# Altium schematic sheet Brushless_Controller.SchDoc
size A
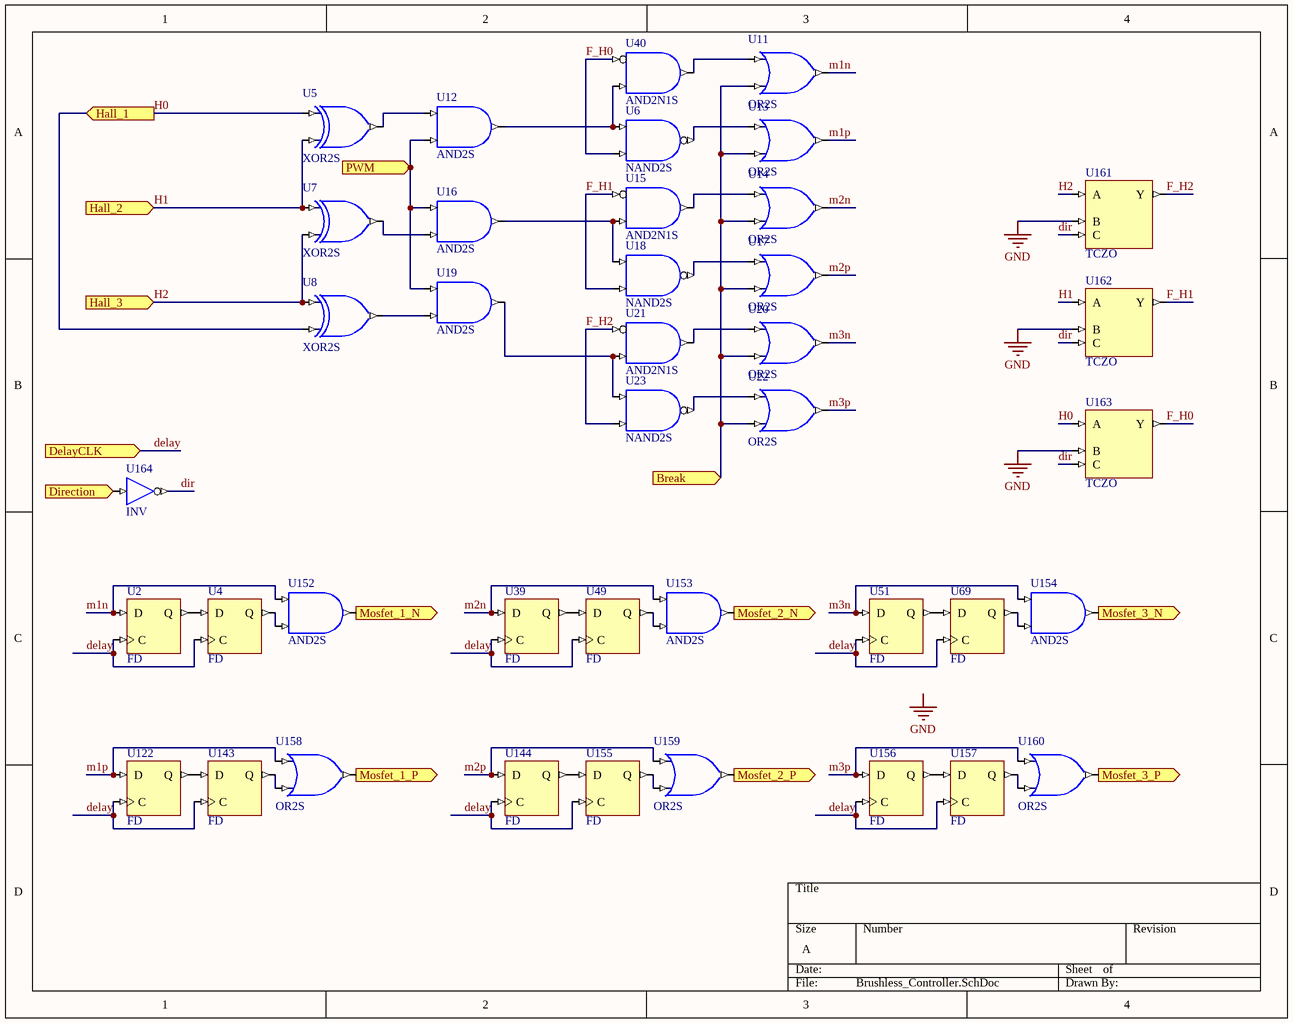
[diagram p0: Brushless_Controller.SchDoc]

## Parts
U2  FD
U4  FD
U5  XOR2S
U6  NAND2S
U7  XOR2S
U8  XOR2S
U11  OR2S
U12  AND2S
U13  OR2S
U14  OR2S
U15  AND2N1S
U16  AND2S
U17  OR2S
U18  NAND2S
U19  AND2S
U20  OR2S
U21  AND2N1S
U22  OR2S
U23  NAND2S
U39  FD
U40  AND2N1S
U49  FD
U51  FD
U69  FD
U122  FD
U143  FD
U144  FD
U152  AND2S
U153  AND2S
U154  AND2S
U155  FD
U156  FD
U157  FD
U158  OR2S
U159  OR2S
U160  OR2S
U161  TCZO
U162  TCZO
U163  TCZO
U164  INV

## Ports
Break (in), DelayCLK (in), Direction (in), Hall_1 (in), Hall_2 (in), Hall_3 (in), Mosfet_1_N (out), Mosfet_1_P (out), Mosfet_2_N (out), Mosfet_2_P (out), Mosfet_3_N (out), Mosfet_3_P (out), PWM (in)

## Nets
GND: U161.B U162.B U163.B
Break: U11.I1 U13.I1 U14.I1 U17.I1 U20.I1 U22.I1 ; port Break
delay: U2.C U4.C U39.C U49.C U51.C U69.C U122.C U143.C U144.C U155.C U156.C U157.C ; port DelayCLK
dir: U161.C U162.C U163.C U164.O
Direction: U164.I ; port Direction
F_H0: U6.I1 U40.I0 U163.Y
F_H1: U15.I0 U18.I1 U162.Y
F_H2: U21.I0 U23.I1 U161.Y
H0: U5.I0 U8.I1 U163.A ; port Hall_1
H1: U5.I1 U7.I0 U162.A ; port Hall_2
H2: U7.I1 U8.I0 U161.A ; port Hall_3
m1n: U2.D U11.O U152.I0
m1p: U13.O U122.D U158.I0
m2n: U14.O U39.D U153.I0
m2p: U17.O U144.D U159.I0
m3n: U20.O U51.D U154.I0
m3p: U22.O U156.D U160.I0
Mosfet_1_N: U152.O ; port Mosfet_1_N
Mosfet_1_P: U158.O ; port Mosfet_1_P
Mosfet_2_N: U153.O ; port Mosfet_2_N
Mosfet_2_P: U159.O ; port Mosfet_2_P
Mosfet_3_N: U154.O ; port Mosfet_3_N
Mosfet_3_P: U160.O ; port Mosfet_3_P
PWM: U12.I1 U16.I0 U19.I0 ; port PWM
NetU2_Q: U2.Q U4.D
NetU4_Q: U4.Q U152.I1
NetU5_O: U5.O U12.I0
NetU6_I0: U6.I0 U12.O U40.I1
NetU6_O: U6.O U13.I0
NetU7_O: U7.O U16.I1
NetU8_O: U8.O U19.I1
NetU11_I0: U11.I0 U40.O
NetU14_I0: U14.I0 U15.O
NetU15_I1: U15.I1 U16.O U18.I0
NetU17_I0: U17.I0 U18.O
NetU19_O: U19.O U21.I1 U23.I0
NetU20_I0: U20.I0 U21.O
NetU22_I0: U22.I0 U23.O
NetU39_Q: U39.Q U49.D
NetU49_Q: U49.Q U153.I1
NetU51_Q: U51.Q U69.D
NetU69_Q: U69.Q U154.I1
NetU122_Q: U122.Q U143.D
NetU143_Q: U143.Q U158.I1
NetU144_Q: U144.Q U155.D
NetU155_Q: U155.Q U159.I1
NetU156_Q: U156.Q U157.D
NetU157_Q: U157.Q U160.I1

## Notes on the sheet
- Labels drawn without touching a wire or pin: GND

## Library data of the parts
U2 U4 U39 U49 U51 U69 U122 U143 U144 U155-U157 = FD: D-Type Flip-Flop; ClockTrigger: Rising; ArchiveName: GENERIC; VHDLIB_SIM: GENERIC_LIB; Published: 29-Jan-2004; Publisher: Altium Limited; XilinxEquivalent: FD; LastRevisionNo: 1.00.00; HelpURL: CR0118 FPGA Generic Library Guide.pdf#page=170; ComponentLink1URL: CR0133 FPGA Flip Flop Resource Usage.pdf#page=4; ComponentLink1Description: Core &Resource Usage; FunctionalClass: Flip-Flop; SubClass: FD
U5 U7 U8 = XOR2: 2-Input Exclusive-OR Gate, Single Pin Version; XilinxEquivalent: XOR2; FunctionalClass: Logic Primitive; SubClass: XOR; PortSize: 2; ArchiveName: GENERIC; VHDLIB_SIM: GENERIC_LIB; Published: 29-Jan-2004; Publisher: Altium Limited; LastRevisionNo: 1.00.00; HelpURL: CR0118 FPGA Generic Library Guide.pdf#page=448; ComponentLink1URL: CR0136 FPGA Logic Primitive Resource Usage.pdf#page=301; ComponentLink1Description: Core &Resource Usage; PortStyle: Single Pin Version
U6 U18 U23 = NAND2: 2-Input NAND Gate, Single Pin Version; XilinxEquivalent: NAND2; FunctionalClass: Logic Primitive; PortSize: 2; ArchiveName: GENERIC; VHDLIB_SIM: GENERIC_LIB; Published: 29-Jan-2004; Publisher: Altium Limited; LastRevisionNo: 1.00.00; HelpURL: CR0118 FPGA Generic Library Guide.pdf#page=402; ComponentLink1URL: CR0136 FPGA Logic Primitive Resource Usage.pdf#page=90; ComponentLink1Description: Core &Resource Usage; SubClass: NAND; PortStyle: Single Pin Version
U11 U13 U14 U17 U20 U22 U158-U160 = OR2: 2-Input OR Gate, Single Pin Version; XilinxEquivalent: OR2; FunctionalClass: Logic Primitive; PortSize: 2; ArchiveName: GENERIC; VHDLIB_SIM: GENERIC_LIB; Published: 29-Jan-2004; Publisher: Altium Limited; LastRevisionNo: 1.00.00; HelpURL: CR0118 FPGA Generic Library Guide.pdf#page=410; ComponentLink1URL: CR0136 FPGA Logic Primitive Resource Usage.pdf#page=190; ComponentLink1Description: Core &Resource Usage; SubClass: OR; PortStyle: Single Pin Version
U12 U16 U19 U152-U154 = AND2: 2-Input AND Gate, Single Pin Version; XilinxEquivalent: AND2; FunctionalClass: Logic Primitive; PortSize: 2; ArchiveName: GENERIC; VHDLIB_SIM: GENERIC_LIB; Published: 29-Jan-2004; Publisher: Altium Limited; LastRevisionNo: 1.00.00; HelpURL: CR0118 FPGA Generic Library Guide.pdf#page=114; ComponentLink1URL: CR0136 FPGA Logic Primitive Resource Usage.pdf#page=13; ComponentLink1Description: Core &Resource Usage; SubClass: AND; PortStyle: Single Pin Version
U15 U21 U40 = AND2B1: 2-Input AND Gate with Active Low A Input, Single Pin Version; XilinxEquivalent: AND2B1; FunctionalClass: Logic Primitive; PortSize: 2; ArchiveName: GENERIC; VHDLIB_SIM: GENERIC_LIB; Published: 29-Jan-2004; Publisher: Altium Limited; LastRevisionNo: 1.00.00; HelpURL: CR0118 FPGA Generic Library Guide.pdf#page=114; ComponentLink1URL: CR0136 FPGA Logic Primitive Resource Usage.pdf#page=10; ComponentLink1Description: Core &Resource Usage; SubClass: AND; PortStyle: Single Pin Version
U161-U163 = TCZO: True/Complement, Zero/One Element; FunctionalClass: Logic Primitive; ArchiveName: GENERIC; VHDLIB_SIM: GENERIC_LIB; Published: 29-Jan-2004; Publisher: Altium Limited; LastRevisionNo: 1.00.00; HelpURL: CR0118 FPGA Generic Library Guide.pdf#page=444; ComponentLink1URL: CR0136 FPGA Logic Primitive Resource Usage.pdf#page=246; ComponentLink1Description: Core &Resource Usage; SubClass: TCZO
U164 = INV: Inverter; FunctionalClass: Logic Primitive; ArchiveName: GENERIC; VHDLIB_SIM: GENERIC_LIB; Published: 29-Jan-2004; Publisher: Altium Limited; XilinxEquivalent: INV; LastRevisionNo: 1.00.00; HelpURL: CR0118 FPGA Generic Library Guide.pdf#page=291; ComponentLink1URL: CR0136 FPGA Logic Primitive Resource Usage.pdf#page=61; ComponentLink1Description: Core &Resource Usage; SubClass: INV